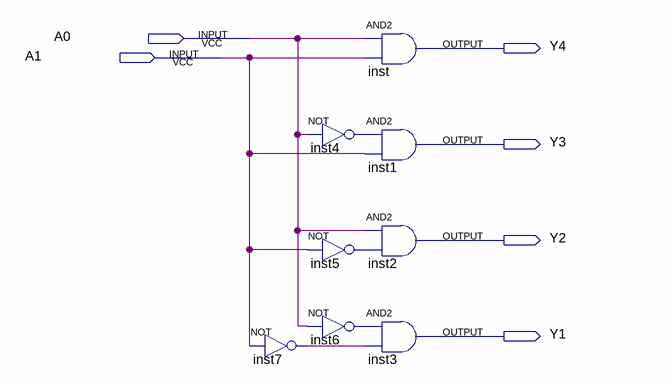
[diagram p0: schematic sheet]
// Quartus schematic decoder_2x4.bdf as structural Verilog: 8 symbols, 6 pins
module decoder_2x4 (
  input  A0,
  input  A1,
  output Y4,
  output Y3,
  output Y2,
  output Y1
);

  wire inst4_out, inst5_out, inst6_out, inst7_out;

  not inst7 (inst7_out, A1);
  not inst4 (inst4_out, A0);
  not inst5 (inst5_out, A1);
  not inst6 (inst6_out, A0);
  and inst (Y4, A0, A1);
  and inst1 (Y3, inst4_out, A1);
  and inst2 (Y2, A0, inst5_out);
  and inst3 (Y1, inst6_out, inst7_out);
endmodule
